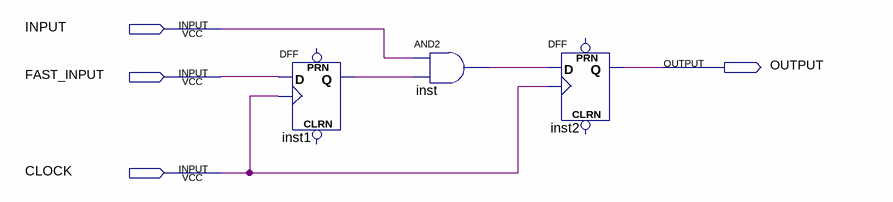
[diagram p0: schematic sheet]
// Quartus schematic TimingCompitoA.bdf as structural Verilog: 3 symbols, 4 pins
module TimingCompitoA (
  input  INPUT,
  input  FAST_INPUT,
  input  CLOCK,
  output OUTPUT
);

  wire inst1_q, inst_out;

  DFF inst1 (.CLK(CLOCK), .D(FAST_INPUT), .Q(inst1_q));  // open: CLRN, PRN
  and inst (inst_out, INPUT, inst1_q);
  DFF inst2 (.CLK(CLOCK), .D(inst_out), .Q(OUTPUT));  // open: CLRN, PRN
endmodule
